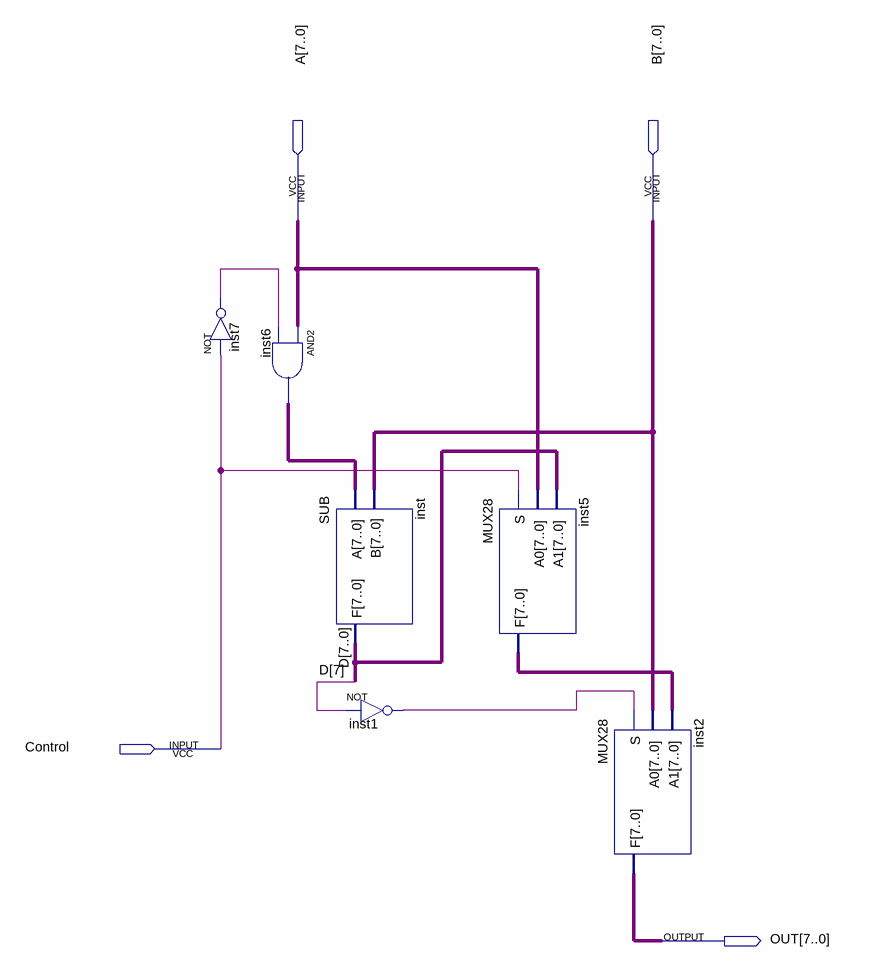
[diagram p0: schematic sheet]
// Quartus schematic ABS_MAX.bdf as structural Verilog: 6 symbols, 4 pins
module ABS_MAX (
  input  [7:0] A,
  input  [7:0] B,
  input  Control,
  output [7:0] OUT
);

  wire inst1_out, inst7_out;
  wire [7:0] D, inst5_f, inst6_out;

  not inst7 (inst7_out, Control);
  assign inst6_out = A & {8{inst7_out}};  // AND2 inst6, 8 bits wide
  SUB inst (.A(inst6_out), .B(B), .F(D));
  not inst1 (inst1_out, D[7]);
  MUX28 inst5 (.S(Control), .A0(A), .A1(D), .F(inst5_f));
  MUX28 inst2 (.S(inst1_out), .A0(B), .A1(inst5_f), .F(OUT));
endmodule
